# Altium schematic sheet Sheet4550_2.SchDoc
size A4
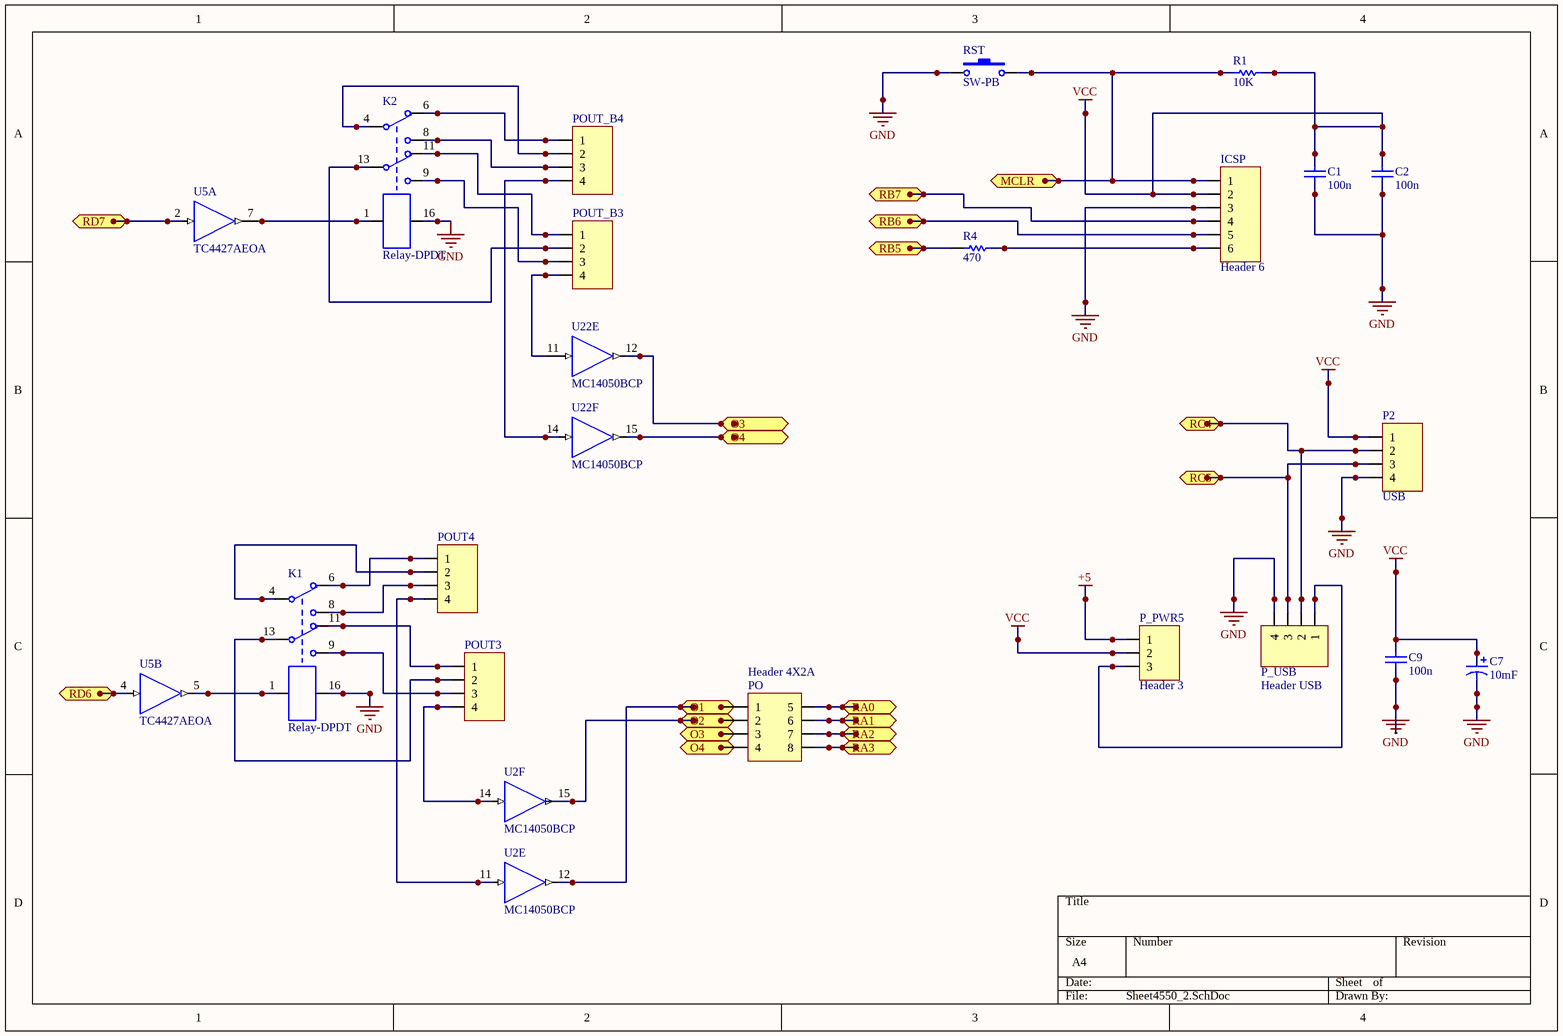
[diagram p0: Sheet4550_2.SchDoc]

## Parts
C1  100n  [CAPC2012L]
C2  100n  [CAPC2012L]
C7  10mF  [CAPC5764L]
C9  100n  [CAPC2012L]
ICSP  Header 6  [HDR1X6]
K1  Relay-DPDT  [DIP-16-KEY]
K2  Relay-DPDT  [DIP-16-KEY]
P2  USB  [HDR1X4]
P_PWR5  Header 3  [HDR1X3]
P_USB  Header USB  [USB2.5-2H4D]
PO  Header 4X2A  [HDR2X4_CEN]
POUT3  Big1  [BIG4]  (value not drawn)
POUT4  Big1  [BIG4]  (value not drawn)
POUT_B3  Big1  [BIG4]  (value not drawn)
POUT_B4  Big1  [BIG4]  (value not drawn)
R1  10K  [RESC3216L]
R4  470  [RESC3216L]
RST  SW-PB  [SPST-2]
U2  MC14050BCP  [648-08]  (parts E,F of 6)
U5  TC4427AEOA  [SOIC-OA8_N]  (parts A,B of 3)
U22  MC14050BCP  [648-08]  (parts E,F of 6)

## Ports
MCLR, O1, O2, O3, O4, RA0, RA1, RA2, RA3, RB5, RB6, RB7, RC4, RC5, RD6, RD7

## Nets
+5: P_PWR5.1
GND: C1.1 C2.1 C7.2 C9.1 ICSP.3 K1.16 K2.16 P2.4 P_USB.4 RST.1 U2.8(GND) U22.8(GND)
VCC: C1.2 C2.2 C7.1 C9.2 ICSP.2 P2.1 P_PWR5.2 R1.2
VDD: U2.1(VDD) U22.1(VDD)
MCLR: ICSP.1 R1.1 RST.2 ; port MCLR
O1: U2.12(OUT) ; port O1
O2: U2.15(OUT) ; port O2
O3: U22.12(OUT) ; port O3
O4: U22.15(OUT) ; port O4
RA0: PO.5 ; port RA0
RA1: PO.6 ; port RA1
RA2: PO.7 ; port RA2
RA3: PO.8 ; port RA3
RB5: R4.1 ; port RB5
RB6: ICSP.5 ; port RB6
RB7: ICSP.4 ; port RB7
RC4: P2.2 P_USB.2 ; port RC4
RC5: P2.3 P_USB.3 ; port RC5
RD6: U5.4(INB) ; port RD6
RD7: U5.2(INA) ; port RD7
NetICSP_6: ICSP.6 R4.2
NetK1_1: K1.1 U5.5(OUTB)
NetK1_4: K1.4 POUT4.2
NetK1_6: K1.6 POUT4.1
NetK1_8: K1.8 POUT4.3
NetK1_9: K1.9 POUT3.3
NetK1_11: K1.11 POUT3.1
NetK1_13: K1.13 POUT3.2
NetK2_1: K2.1 U5.7(OUTA)
NetK2_4: K2.4 POUT_B4.2
NetK2_6: K2.6 POUT_B4.1
NetK2_8: K2.8 POUT_B4.3
NetK2_9: K2.9 POUT_B3.3
NetK2_11: K2.11 POUT_B3.1
NetK2_13: K2.13 POUT_B3.2
NetP_PWR5_3: P_PWR5.3 P_USB.1
NetPOUT3_4: POUT3.4 U2.14(IN)
NetPOUT4_4: POUT4.4 U2.11(IN)
NetPOUT_B3_4: POUT_B3.4 U22.11(IN)
NetPOUT_B4_4: POUT_B4.4 U22.14(IN)

Not connected (* = marked no-connect by the designer): PO 1 2 3 4

## Library data of the parts
C1 C2 C9 = Cap Semi: Capacitor (Semiconductor SIM Model); Published: 8-Jun-2000; LatestRevisionDate: 29-May-2009; LatestRevisionNote: IPC-7351 Footprint Added.; PackageReference: C1206; Publisher: Altium Limited; PackageDescription: Chip Capacitor; Value: 100n
C7 = Cap Pol1: Polarized Capacitor (Radial); Published: 8-Jun-2000; LatestRevisionDate: 17-Jul-2002; LatestRevisionNote: Re-released for DXP Platform.; PackageReference: RB7.6-15; Publisher: Altium Limited; Value: 10mF
ICSP = Header 6: Header, 6-Pin; LatestRevisionDate: 17-Jul-2002; LatestRevisionNote: Re-released for DXP Platform.; Publisher: Altium Limited
K1 K2 = Relay-DPDT: Dual-Pole Dual-Throw Relay; Published: 24-Mar-1999; LatestRevisionDate: 17-Jul-2002; LatestRevisionNote: Re-released for DXP Platform.; PackageReference: DIP-P8; Publisher: Altium Limited
P2 POUT3 POUT4 POUT_B3 POUT_B4 = Header 4: Header, 4-Pin; LatestRevisionDate: 17-Jul-2002; LatestRevisionNote: Re-released for DXP Platform.; Publisher: Altium Limited
P_PWR5 = Header 3: Header, 3-Pin; LatestRevisionDate: 17-Jul-2002; LatestRevisionNote: Re-released for DXP Platform.; Publisher: Altium Limited
P_USB = Header_USB: Header, 4-Pin; LatestRevisionDate: 17-Jul-2002; LatestRevisionNote: Re-released for DXP Platform.; Publisher: Altium Limited
PO = Header 4X2A: Header, 4-Pin, Dual row; LatestRevisionDate: 17-Jul-2002; LatestRevisionNote: Re-released for DXP Platform.; Publisher: Altium Limited
R1 R4 = Res Semi: Semiconductor Resistor; Published: 8-Jun-2000; LatestRevisionDate: 17-Jul-2002; LatestRevisionNote: Re-released for DXP Platform.; PackageReference: AXIAL-0.5; Publisher: Altium Limited
  R1: Value: 10K
  R4: Value: 470
RST = SW-PB: Switch; Published: 24-Mar-1999; LatestRevisionDate: 17-Jul-2002; LatestRevisionNote: Re-released for DXP Platform.; PackageReference: SPST-2; Publisher: Altium Limited
U2 U22 = MC14050BCP: Hex Non-Inverting Buffer; Note: NC Pins are 13,16; Published: 15-Apr-2002; DatasheetVersion: 1995; PackageVersion: Apr-2000; PackageReference: 648-08; Publisher: Altium Limited; PackageDescription: DIP; 16 Leads; Row Spacing 7.62 mm; Pitch 2.54 mm; Code_JEDEC: MS-001-BB; ComponentLink1Description: Manufacturer Link; ComponentLink1URL: http://www.onsemi.com/; ComponentLink2Description: Datasheet; ComponentLink2URL: http://www.onsemi.com/pub/Collateral/MC14049B-D.PDF
U5 = TC4427AEOA: 1.5A Dual High-Speed Power MOSFET Driver, Non-Inverting, Industrial Temperature; FirstPublished: 29-Jan-2009; DatasheetVersion: revF, Jan-2006; PackageVersion: revBB, Aug-2009; PackageReference: SOIC-OA8; Publisher: Altium Limited; PackageDescription: 8-Lead Plastic Small Outline (OA) - Narrow, 3.90mm Body [SOIC]; Supplier 1: Digi-Key; Supplier Part Number 1: TC4427AEOA-ND; Supplier 2: Farnell; Supplier Part Number 2: 1292285; Supplier 3: Newark; Supplier Part Number 3: 96K4020; Code_IPC: SOIC127P600-8; ComponentLink1Description: Datasheet; ComponentLink1URL: http://ww1.microchip.com/downloads/en/DeviceDoc/21423F.pdf; ComponentLink2Description: Packaging Specification; ComponentLink2URL: http://www.microchip.com/stellent/groups/techpub_sg/documents/packagingspec/en012702.pdf; ComponentLink3Description: Microchip.com Home; ComponentLink3URL: http://www.microchip.com/